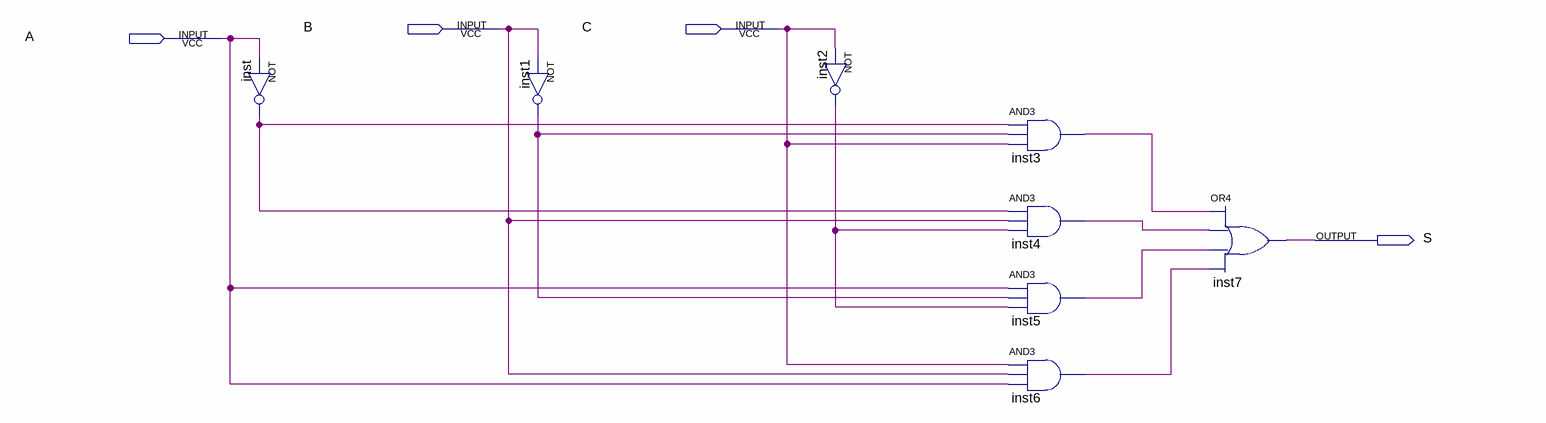
[diagram p0: schematic sheet]
// Quartus schematic expt_1_part_2C.bdf as structural Verilog: 8 symbols, 4 pins
module expt_1_part_2C (
  input  B,
  input  C,
  input  A,
  output S
);

  wire inst1_out, inst2_out, inst3_out, inst4_out, inst5_out, inst6_out, inst_out;

  not inst (inst_out, A);
  not inst1 (inst1_out, B);
  not inst2 (inst2_out, C);
  and inst3 (inst3_out, inst_out, inst1_out, C);
  and inst4 (inst4_out, inst_out, B, inst2_out);
  and inst5 (inst5_out, A, inst1_out, inst2_out);
  and inst6 (inst6_out, C, B, A);
  or inst7 (S, inst3_out, inst4_out, inst5_out, inst6_out);
endmodule
